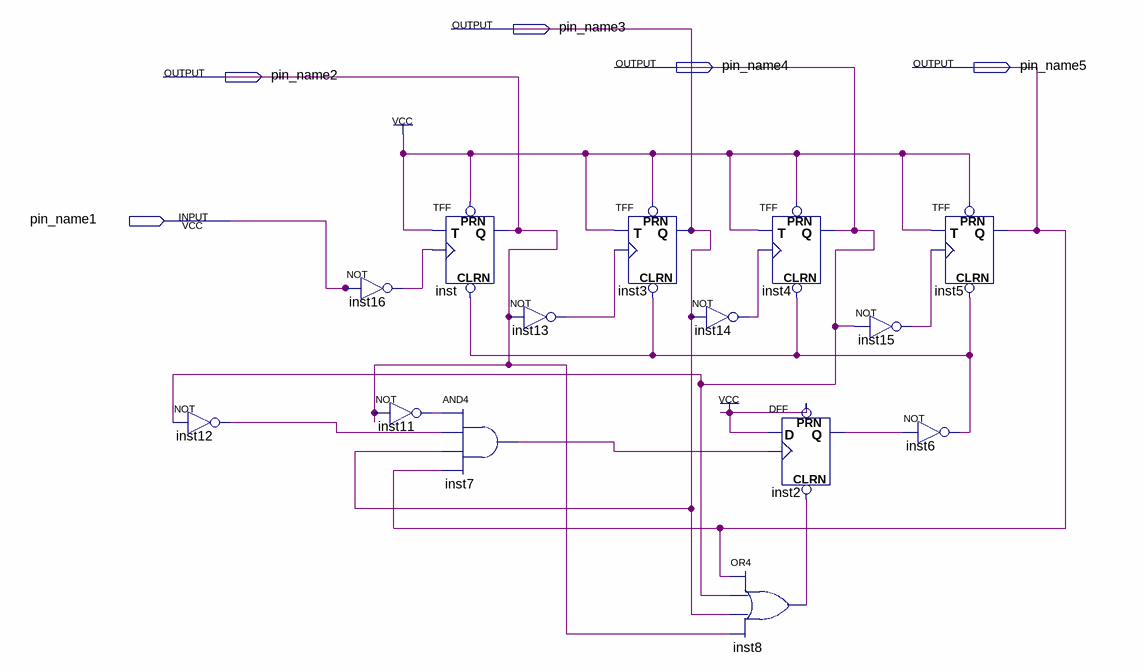
[diagram p0: schematic sheet]
// Quartus schematic lab_02.bdf as structural Verilog: 14 symbols, 5 pins
module lab_02 (
  input  pin_name1,
  output pin_name3,
  output pin_name4,
  output pin_name5,
  output pin_name2
);

  wire inst2_q, inst6_out, inst7_out, inst8_out, inst11_out, inst12_out, inst13_out, inst14_out, inst15_out,
       inst16_out;

  not inst12 (inst12_out, pin_name4);
  not inst16 (inst16_out, pin_name1);
  TFF inst (.PRN(1'b1), .CLRN(inst6_out), .T(1'b1), .CLK(inst16_out), .Q(pin_name2));
  and inst7 (inst7_out, inst11_out, inst12_out, pin_name3, pin_name5);
  not inst11 (inst11_out, pin_name2);
  not inst13 (inst13_out, pin_name2);
  TFF inst3 (.PRN(1'b1), .CLRN(inst6_out), .T(1'b1), .CLK(inst13_out), .Q(pin_name3));
  not inst14 (inst14_out, pin_name3);
  or inst8 (inst8_out, pin_name5, pin_name4, pin_name3, pin_name2);
  TFF inst4 (.PRN(1'b1), .CLRN(inst6_out), .T(1'b1), .CLK(inst14_out), .Q(pin_name4));
  DFF inst2 (.CLRN(inst8_out), .CLK(inst7_out), .D(1'b1), .PRN(1'b1), .Q(inst2_q));
  not inst15 (inst15_out, pin_name4);
  not inst6 (inst6_out, inst2_q);
  TFF inst5 (.PRN(1'b1), .CLRN(inst6_out), .T(1'b1), .CLK(inst15_out), .Q(pin_name5));
endmodule
